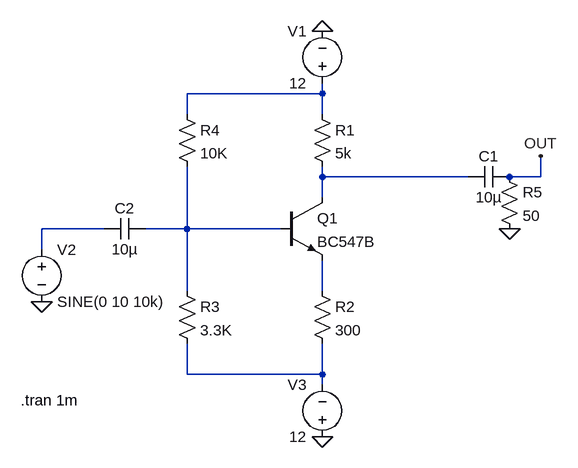
[diagram p0: schematic ClassA_amplifier.asc]
ClassA_amplifier.asc, the LTspice schematic file:
Version 4
SHEET 1 880 680
WIRE 288 -64 288 -80
WIRE 288 -64 80 -64
WIRE 80 -32 80 -64
WIRE 288 -32 288 -64
WIRE 288 64 288 48
WIRE 512 64 288 64
WIRE 624 64 624 32
WIRE 624 64 576 64
WIRE 288 96 288 64
WIRE -48 144 -144 144
WIRE 80 144 80 48
WIRE 80 144 16 144
WIRE 224 144 80 144
WIRE -144 176 -144 144
WIRE 80 240 80 144
WIRE 288 240 288 192
WIRE 80 368 80 320
WIRE 288 368 288 320
WIRE 288 368 80 368
WIRE 288 384 288 368
FLAG 288 -160 0
FLAG 624 32 OUT
FLAG -144 256 0
FLAG 576 144 0
FLAG 288 464 0
SYMBOL npn 224 96 R0
SYMATTR InstName Q1
SYMATTR Value BC547B
SYMBOL voltage 288 -64 R180
WINDOW 0 24 96 Left 2
WINDOW 3 24 16 Left 2
WINDOW 123 0 0 Left 0
WINDOW 39 0 0 Left 0
SYMATTR InstName V1
SYMATTR Value 12
SYMBOL res 272 -48 R0
SYMATTR InstName R1
SYMATTR Value 5k
SYMBOL res 272 224 R0
SYMATTR InstName R2
SYMATTR Value 300
SYMBOL res 64 224 R0
SYMATTR InstName R3
SYMATTR Value 3.3K
SYMBOL res 64 -48 R0
SYMATTR InstName R4
SYMATTR Value 10K
SYMBOL voltage -144 160 R0
WINDOW 123 0 0 Left 0
WINDOW 39 0 0 Left 0
SYMATTR InstName V2
SYMATTR Value SINE(0 10 10k)
SYMBOL cap 576 48 R90
WINDOW 0 0 32 VBottom 2
WINDOW 3 32 32 VTop 2
SYMATTR InstName C1
SYMATTR Value 10µ
SYMBOL res 560 48 R0
SYMATTR InstName R5
SYMATTR Value 50
SYMBOL cap 16 128 R90
WINDOW 0 0 32 VBottom 2
WINDOW 3 32 32 VTop 2
SYMATTR InstName C2
SYMATTR Value 10µ
SYMBOL voltage 288 480 R180
WINDOW 0 24 96 Left 2
WINDOW 3 24 16 Left 2
WINDOW 123 0 0 Left 0
WINDOW 39 0 0 Left 0
SYMATTR InstName V3
SYMATTR Value 12
TEXT -176 408 Left 2 !.tran 1m

The netlist it stands for:
* ClassA_amplifier.asc
Q1 N002 N004 N005 0 BC547B
V1 N001 0 12
R1 N001 N002 5k
R2 N005 N006 300
R3 N004 N006 3.3K
R4 N001 N004 10K
V2 N003 0 SINE(0 10 10k)
C1 OUT N002 10µ
R5 OUT 0 50
C2 N004 N003 10µ
V3 0 N006 12
.model NPN NPN
.model PNP PNP
.lib standard.bjt
.tran 1m
.backanno
.end